# EAGLE schematic npn reflex (EAGLE 5.11)
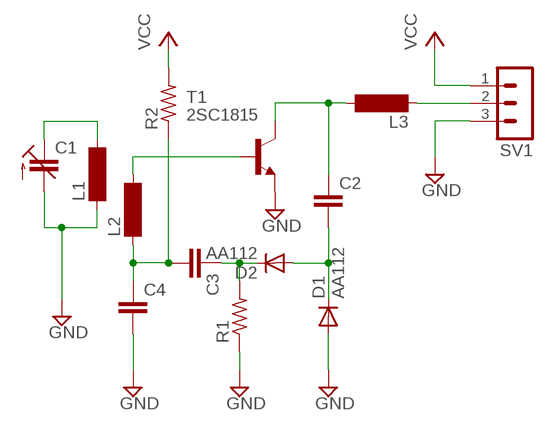
[diagram p0: schematic, sheet 1]

## Parts
C1  C-TRIMM808  [CTRIM808-BC]
C2  C-EU025-024X044  [C025-024X044]
C3  C-EU025-024X044  [C025-024X044]
C4  C-EU025-024X044  [C025-024X044]
D1  AA112  [DO07]
D2  AA112  [DO07]
L1  SM-L15B  [SM-L15B]
L2  SM-L15B  [SM-L15B]
L3  SM-L15B  [SM-L15B]
R1  R-US_0204/5  [0204/5]
R2  R-US_0204/5  [0204/5]
SV1  MA03-1  [MA03-1]
T1  2SC1815  [TO92-ECB]

## Nets
GND: C1.2(A) C4.2 D1.A L1.1 R1.1 SV1.3 T1.E
N$2: C1.1(E) L1.2
N$3: L2.2 T1.B
N$4: C3.2 C4.1 L2.1 R2.1
N$5: C3.1 D2.C R1.2
N$7: L3.1 SV1.2
N$8: C2.2 D1.C D2.A
N$9: C2.1 L3.2 T1.C
VCC: R2.2 SV1.1

## Library data of the parts
C1 = rcl:C-TRIMM: Trimm capacitor
C2-C4 = rcl:C-EU: CAPACITOR, European symbol
D1 D2 = diode:AA112: DIODE germanium
L1-L3 = inductor-neosid:SM-L15: INDUCTOR SMD air coil with pick and place cap; OC_FARNELL: unknown; OC_NEWARK: unknown
R1 R2 = rcl:R-US_: RESISTOR, American symbol
SV1 = con-lstb:MA03-1: PIN HEADER; OC_FARNELL: unknown; OC_NEWARK: unknown
T1 = transistor:2SC1815: NPN EPITAXIAL TRANSISTOR Source: TOSHIBA .. 2SC1815 1.pdf